# Altium schematic sheet Schematic block.SchDoc
size A4; SheetNumber: 1; SheetTotal: 6
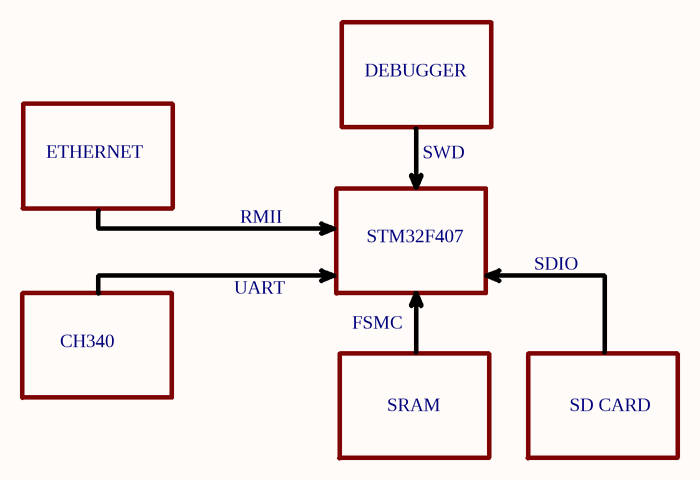
[diagram p0: Schematic block.SchDoc]

## Notes on the sheet
- DEBUGGER
- ETHERNET
- SWD
- RMII
- UART
- STM32F407
- SDIO
- CH340
- FSMC
- SRAM
- SD CARD